# Altium schematic sheet [03] - POWER SUPPLY.SchDoc
size A3; DocumentNumber: 2; SheetNumber: 3; SheetTotal: 9
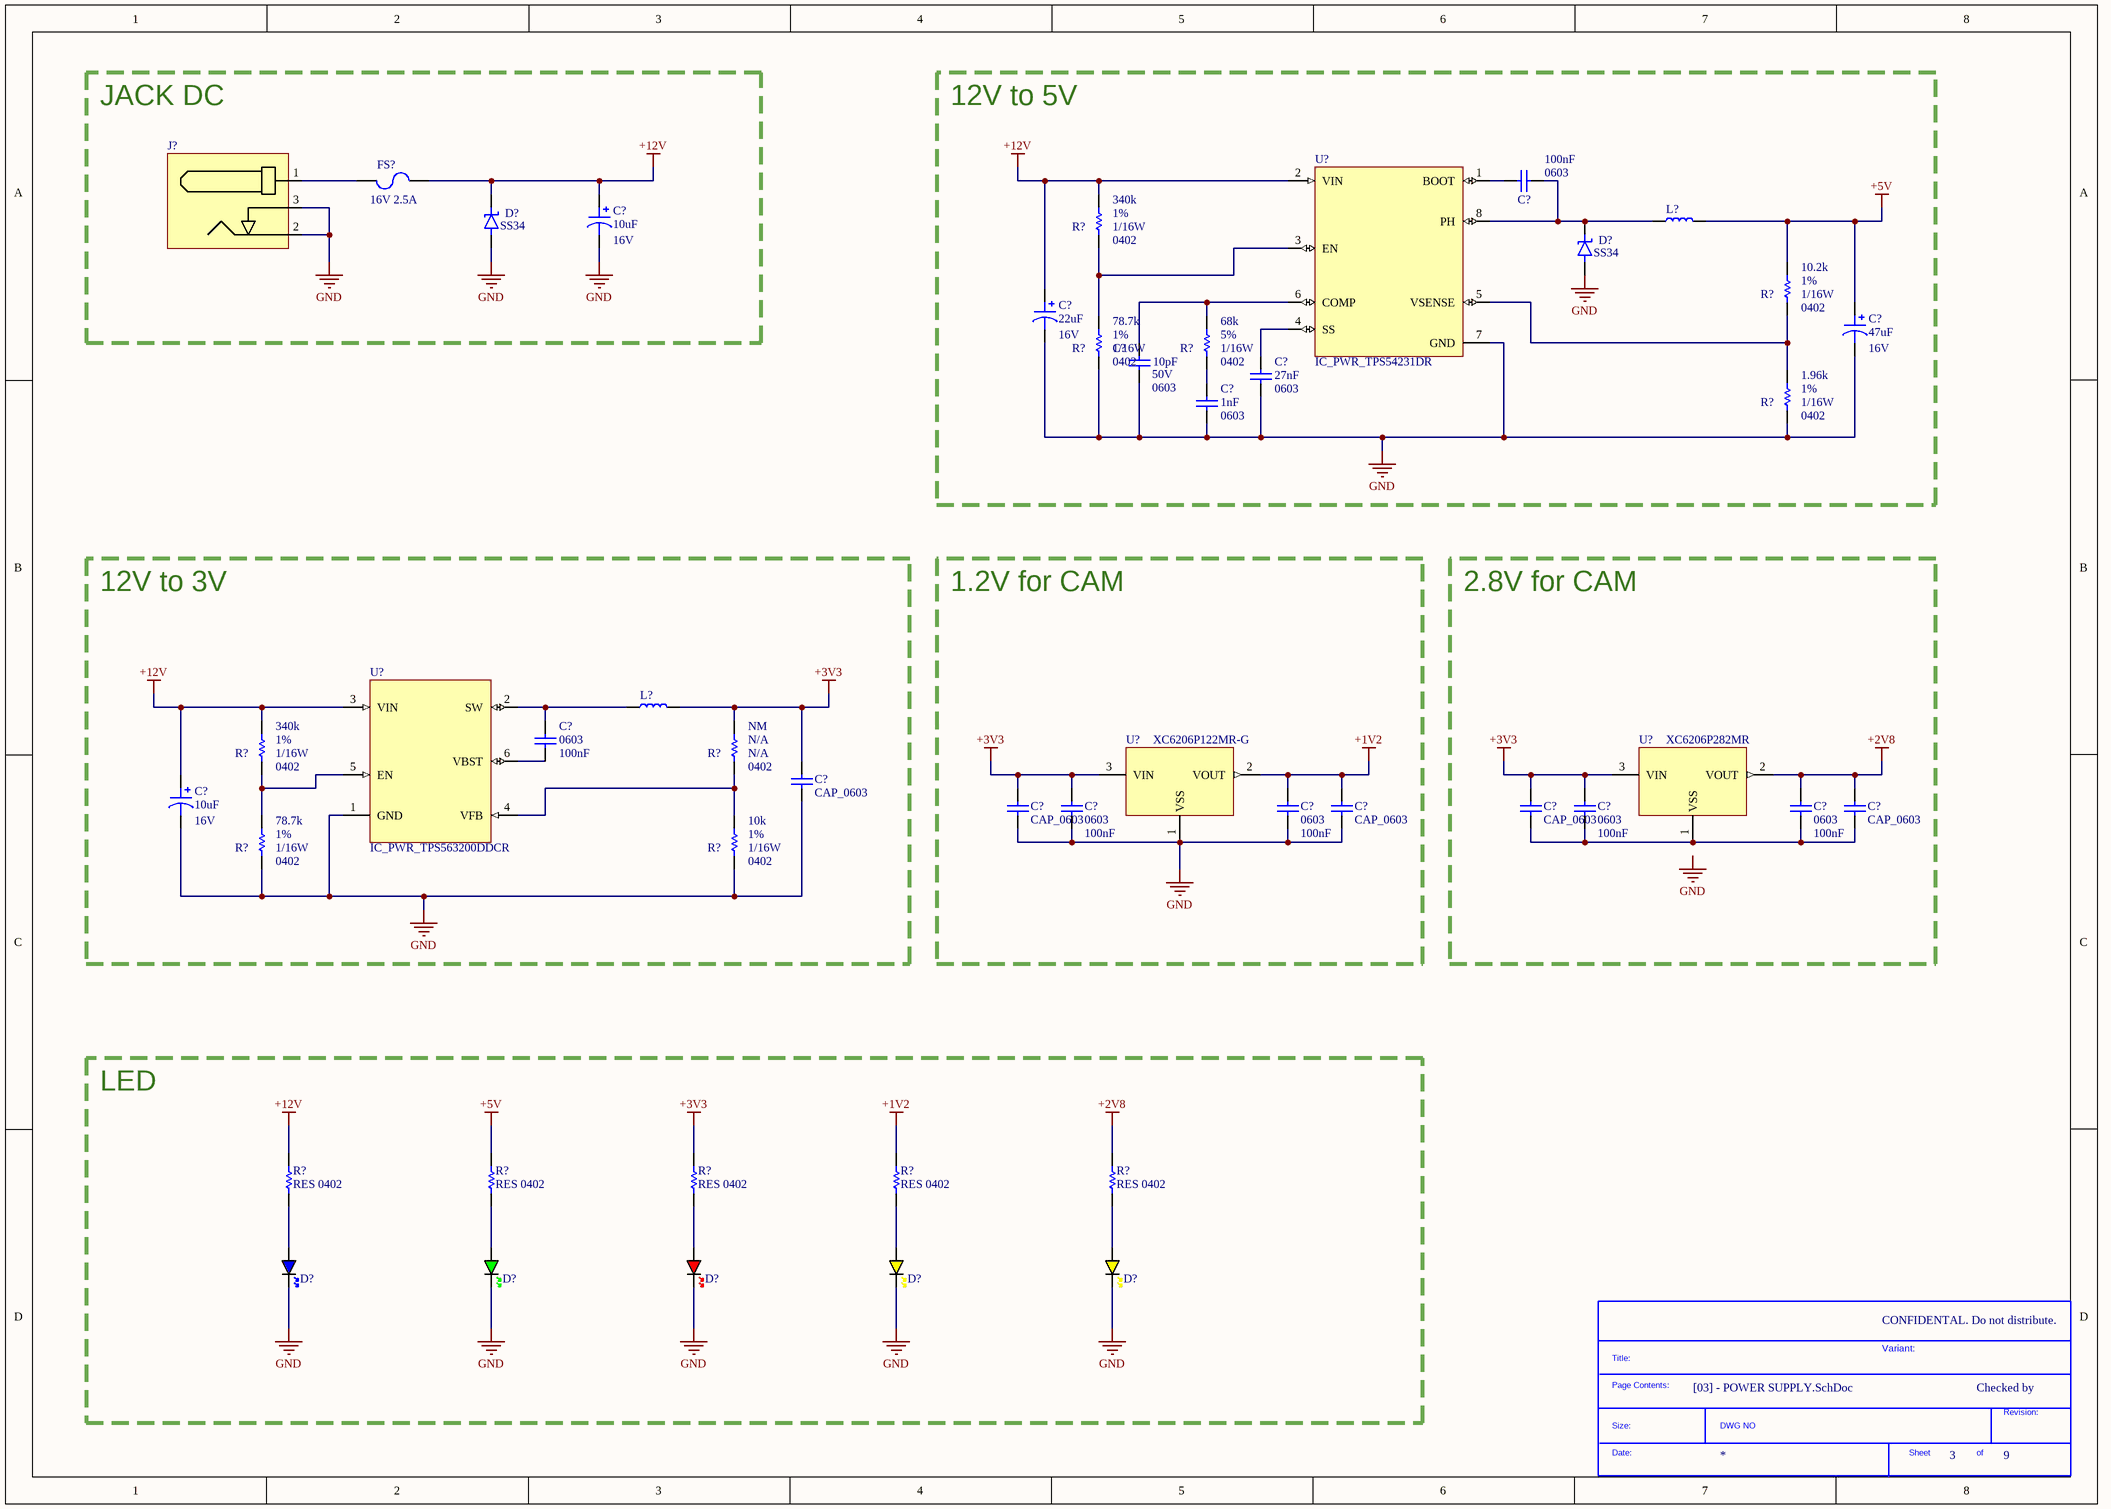
[diagram p0: [03] - POWER SUPPLY.SchDoc]

## Parts
(Parts that share a designator on the sheet are numbered #1, #2 ... from top to bottom, then left to right.)
*  SDTitleBlock  (value not drawn)  (graphical)
C?#1  Package / Case: 0603  Capacitance: 100nF  [CAP_0603]  (hidden comment: CAP_0603)
C?#2  10uF  Voltage Rating DC: 16V  [CAP TAN 1411]
C?#3  22uF  Voltage Rating DC: 16V  [CAP_TAN-2312]
C?#4  47uF  Voltage Rating DC: 16V  [CAP_TAN-2312]
C?#5  Voltage Rating DC: 50V  Package / Case: 0603  Capacitance: 10pF  [CAP_0603]  (hidden comment: CAP_0603)
C?#6  Package / Case: 0603  Capacitance: 27nF  [CAP_0603]  (hidden comment: CAP_0603)
C?#7  Package / Case: 0603  Capacitance: 1nF  [CAP_0603]  (hidden comment: CAP_0603)
C?#8  Package / Case: 0603  Capacitance: 100nF  [CAP_0603]  (hidden comment: CAP_0603)
C?#9  Package / Case: 0603  Capacitance: 100nF  [CAP_0603]  (hidden comment: CAP_0603)
C?#10  Package / Case: 0603  Capacitance: 100nF  [CAP_0603]  (hidden comment: CAP_0603)
C?#11  Package / Case: 0603  Capacitance: 100nF  [CAP_0603]  (hidden comment: CAP_0603)
C?#12  Package / Case: 0603  Capacitance: 100nF  [CAP_0603]  (hidden comment: CAP_0603)
C?#13  10uF  Voltage Rating DC: 16V  [CAP TAN 1206]
C?#14  CAP_0603  [CAP_0603]
C?#15  CAP_0603  [CAP_0603]
C?#16  CAP_0603  [CAP_0603]
C?#17  CAP_0603  [CAP_0603]
C?#18  CAP_0603  [CAP_0603]
D?#1  SS34  [DO-214AC-2 (SMA)]
D?#2  SS34  [DO-214AC-2 (SMA)]
D?#3  BLUE  [LED_0603_BLUE]  (value not drawn)
D?#4  GREEN  [LED_0603_GREEN]  (value not drawn)
D?#5  RED  [LED_0603_BLUE]  (value not drawn)
D?#6  YELLOW  [LED_0603_YELLOW]  (value not drawn)
D?#7  YELLOW  [LED_0603_YELLOW]  (value not drawn)
FS?  16V 2.5A  [FUSE_1812]
J?  DC-005-5A-3.0  [CONN_PWR_DC-005-5A-3.0]  (value not drawn)
L?#1  L0603  [IND_0603]  (value not drawn)
L?#2  L0402  [IND_0402]  (value not drawn)
R?#1  Tolerance: 1%  Rated Power: 1/16W  Package / Case: 0402  Resistance: 340k  [RES_0402]  (hidden comment: RES 0402)
R?#2  Tolerance: 1%  Rated Power: 1/16W  Package / Case: 0402  Resistance: 10.2k  [RES_0402]  (hidden comment: RES 0402)
R?#3  Tolerance: 1%  Rated Power: 1/16W  Package / Case: 0402  Resistance: 78.7k  [RES_0402]  (hidden comment: RES 0402)
R?#4  Tolerance: 5%  Rated Power: 1/16W  Package / Case: 0402  Resistance: 68k  [RES_0402]  (hidden comment: RES 0402)
R?#5  Tolerance: 1%  Rated Power: 1/16W  Package / Case: 0402  Resistance: 1.96k  [RES_0402]  (hidden comment: RES 0402)
R?#6  Tolerance: 1%  Rated Power: 1/16W  Package / Case: 0402  Resistance: 340k  [RES_0402]  (hidden comment: RES 0402)
R?#7  Package / Case: 0402  Resistance: NM  [RES_0402]  (hidden comment: RES 0402)
R?#8  Tolerance: 1%  Rated Power: 1/16W  Package / Case: 0402  Resistance: 78.7k  [RES_0402]  (hidden comment: RES 0402)
R?#9  Tolerance: 1%  Rated Power: 1/16W  Package / Case: 0402  Resistance: 10k  [RES_0402]  (hidden comment: RES 0402)
R?#10  RES 0402  [RES_0402]
R?#11  RES 0402  [RES_0402]
R?#12  RES 0402  [RES_0402]
R?#13  RES 0402  [RES_0402]
R?#14  RES 0402  [RES_0402]
U?#1  IC_PWR_TPS54231DR  [PKG_SOIC-8]
U?#2  IC_PWR_TPS563200DDCR  [PKG_SOT-23-6]
U?#3  XC6206P122MR-G  [PKG_SOT-23-3]
U?#4  XC6206P282MR  [PKG_SOT-23-3]

## Blocks framed on the sheet
JACK DC: C?#2 D?#1 FS? J?
12V to 5V: C?#1 C?#3-C?#7 D?#2 L?#1 R?#1-R?#5 U?#1
12V to 3V: C?#8 C?#13 C?#14 L?#2 R?#6-R?#9 U?#2
1.2V for CAM: C?#9 C?#10 C?#15 C?#16 U?#3
2.8V for CAM: C?#11 C?#12 C?#17 C?#18 U?#4
LED: D?#3-D?#7 R?#10-R?#14

## Nets
+1V2: C?#10.1 C?#16.2 R?#13.2 U?#3.2(VOUT)
+2V8: C?#12.1 C?#18.2 R?#14.2 U?#4.2(VOUT)
+3V3: C?#9.1 C?#11.1 C?#14.2 C?#15.2 C?#17.2 L?#2.2 R?#7.2 R?#12.2 U?#3.3(VIN) U?#4.3(VIN)
+5V: C?#4.1 L?#1.2 R?#2.2 R?#11.2
+12V: C?#2.1 C?#3.1 C?#13.1 D?#1.K FS?.2 R?#1.2 R?#6.2 R?#10.2 U?#1.2(VIN) U?#2.3(VIN)
GND: C?#2.2 C?#3.2 C?#4.2 C?#5.1 C?#6.1 C?#7.1 C?#9.2 C?#10.2 C?#13.2 C?#14.1 C?#15.1 C?#16.1 D?#1.A D?#2.A D?#3.K D?#4.K D?#5.K D?#6.K D?#7.K J?.2 J?.3 R?#3.1 R?#5.1 R?#8.1 R?#9.1 U?#1.7(GND) U?#2.1(GND) U?#3.1(VSS)
NetC?#1_1: C?#1.1 D?#2.K L?#1.1 U?#1.8(PH)
NetC?#1_2: C?#1.2 U?#1.1(BOOT)
NetC?#5_2: C?#5.2 R?#4.2 U?#1.6(COMP)
NetC?#6_2: C?#6.2 U?#1.4(SS)
NetC?#7_2: C?#7.2 R?#4.1
NetC?#8_1: C?#8.1 L?#2.1 U?#2.2(SW)
NetC?#8_2: C?#8.2 U?#2.6(VBST)
NetC?#11_2: C?#11.2 C?#12.2 C?#17.1 C?#18.1 U?#4.1(VSS)
NetD?#3_A: D?#3.A R?#10.1
NetD?#4_A: D?#4.A R?#11.1
NetD?#5_A: D?#5.A R?#12.1
NetD?#6_A: D?#6.A R?#13.1
NetD?#7_A: D?#7.A R?#14.1
NetFS?_1: FS?.1 J?.1
NetR?#1_1: R?#1.1 R?#3.2 U?#1.3(EN)
NetR?#2_1: R?#2.1 R?#5.2 U?#1.5(VSENSE)
NetR?#6_1: R?#6.1 R?#8.2 U?#2.5(EN)
NetR?#7_1: R?#7.1 R?#9.2 U?#2.4(VFB)

## Notes on the sheet
- CLOCKS (CPU & PCIE)
- CONFIDENTAL. Do not distribute.
- Variant:
- Checked by
- Labels drawn without touching a wire or pin: GND
- (in symbol SDTitleBlock) Title:; Page Contents:; Revision:; Size:; DWG NO; Date:; Sheet; of

## Library data of the parts
C?#1 C?#6 C?#8-C?#12 = CAP_0603_NM: CAP, size 0603, NM, N/A; Tolerance: 10%; Voltage Rating DC: 50V; Packaging: Tape and Reel; Supplier: thegioiic; ComponentLink1Description: Datasheet; ComponentLink1URL: N/A; Mount: SMD/SMT; Operating Temperature Max: + 85 C; Operating Temperature Min: - 40 C
  C?#1 C?#8-C?#12: Supplier URL: https://www.thegioiic.com/tu-gom-0603-100nf-0-1uf-50v; Supplier Part Number: Tụ Gốm 0603 100nF (0.1uF) 50V
  C?#6: Supplier URL: https://www.thegioiic.com/tu-gom-0603-27nf-50v; Supplier Part Number: Tụ Gốm 0603 27nF 50V
C?#2-C?#4 = CAP_POL_NM: CAP, size NM, NM, N/A; Tolerance: 10%; Packaging: Tape and Reel; Supplier: thegioiic; ComponentLink1Description: Datasheet; ComponentLink1URL: N/A; Mount: SMD/SMT; Operating Temperature Max: + 85 C; Operating Temperature Min: - 40 C; Material: NM
  C?#2: Capacitance: 10uF; Supplier URL: https://www.thegioiic.com/tu-tantalum-10uf-16v-1206-taja106k016rnj; Supplier Part Number: TAJA106K016RNJ; Package / Case: N/A
  C?#3: Capacitance: 22uF; Supplier URL: https://www.thegioiic.com/tu-tantalum-22uf-16v-2312-tajc226k016rnj; Supplier Part Number: TAJC226K016RNJ; Package / Case: 2312
  C?#4: Capacitance: 47uF; Supplier URL: https://www.thegioiic.com/tu-tantalum-47uf-16v-2312-tajc476k016rnj; Supplier Part Number: TAJC476K016RNJ; Package / Case: 2312
C?#5 = CAP_0603_NM: CAP, size 0603, NM, N/A; Tolerance: 10%; Packaging: Tape and Reel; Supplier URL: https://www.thegioiic.com/tu-gom-0603-10pf-50v; Supplier: thegioiic; Supplier Part Number: Tụ Gốm 0603 10pF 50V; ComponentLink1Description: Datasheet; ComponentLink1URL: N/A; Mount: SMD/SMT; Operating Temperature Max: + 85 C; Operating Temperature Min: - 40 C
C?#7 = CAP_0603_NM: CAP, size 0603, NM, N/A; Tolerance: 10%; Voltage Rating DC: 50; Packaging: Tape and Reel; Supplier URL: https://www.thegioiic.com/tu-gom-0603-1nf-50v; Supplier: thegioiic; Supplier Part Number: Tụ Gốm 0603 1nF 50V; ComponentLink1Description: Datasheet; ComponentLink1URL: N/A; Mount: SMD/SMT; Operating Temperature Max: + 85 C; Operating Temperature Min: - 40 C
C?#13 = CAP_POL_NM: CAP, size NM, NM, N/A; Tolerance: 10%; Material: Tanta; Packaging: Tape and Reel; Capacitance: 10uF; Supplier URL: https://www.thegioiic.com/tu-tantalum-10uf-16v-1206-taja106k016rnj; Supplier: thegioiic; Supplier Part Number: TAJA106K016RNJ; ComponentLink1Description: Datasheet; ComponentLink1URL: N/A; Mount: SMD/SMT; Operating Temperature Max: + 85 C; Operating Temperature Min: - 40 C; Package / Case: 1206
C?#14-C?#18 = CAP_0603_NM: CAP, size 0603, NM, N/A; Packaging: Tape and Reel; Capacitance: N/A; Supplier URL: N/A; Tolerance: N/A; Voltage Rating DC: N/A; Supplier: N/A; Supplier Part Number: N/A; ComponentLink1Description: Datasheet; ComponentLink1URL: N/A; Mount: SMD/SMT; Operating Temperature Max: + 85 C; Operating Temperature Min: - 40 C; Package / Case: 0603
D?#1 D?#2 = D_SCHOTTKY_SMA: Diode Schottky SMD SMA (DO-214AA); Supplier: thegioiic; Supplier Part Number: TWGMC SS34 SMA; Supplier URL: https://www.thegioiic.com/twgmc-ss34-sma-diode-schottky-3a
D?#3 = LED_0603_BLUE: LED 0603 BLUE SMD; COLOR: BLUE; SIZE: 0603; Supplier: N/A; Supplier Part Number: N/A; Supplier URL: N/A
D?#4 = LED_0603_GREEN: LED 0603 GREEN SMD; COLOR: GREEN; SIZE: 0603; Supplier: N/A; Supplier Part Number: N/A; Supplier URL: N/A
D?#5 = LED_0603_RED: LED 0603 RED SMD; COLOR: RED; SIZE: 0603; Supplier: N/A; Supplier Part Number: N/A; Supplier URL: N/A
D?#6 D?#7 = LED_0603_YELLOW: LED 0603 YELLOW SMD; COLOR: YELLOW; SIZE: 0603; Supplier: N/A; Supplier Part Number: N/A; Supplier URL: N/A
FS? = FUSE_1206: Fuse; Supplier backup URL: N/A; Packaging: Tape and Reel; Supplier: thegioiic; Supplier Part Number: MF-MSMF250/16; Supplier backup: N/A; Supplier backup Part Number: N/A; Tolerance: N/A; Manufacturer: N/A; Manufacturer Part Number: N/A; ComponentLink1Description: Datasheet; ComponentLink1URL: N/A; Mount: SMD/SMT; Operating Temperature Max: + 85 C; Operating Temperature Min: - 40 C; Package / Case: 0402; Value: 16V 2.5A; Supplier URL: https://www.thegioiic.com/mf-msmf250-16-cau-chi-tu-phuc-hoi-1812-16v-2-5a
J? = PWR_DC-005-5A-3.0: DC Barrell Jack 6.2mm 5 A3.0mm Through Hole; Supplier: N/A; Supplier Part Number: DC-005-5A-3.0; Supplier URL: N/A
L?#1 = IND_0603: Inductor SMD 0603
L?#2 = IND_SMD: Inductor SMD; Inductance: NM; Current: NM; Supplier: NM; Supplier Part Number: NM; Supplier URL: NM
R?#1 R?#6 = RES_0402_NM: RES, size 0402, NM, N/A; Manufacturer: YAGEO; Manufacturer Part Number: RC0402FR-07340KL; Supplier backup URL: https://www.mouser.vn/ProductDetail/YAGEO/RC0100FR-07340KL?qs=tggtontpCXM9OHWbJDQFHg%3D%3D; Packaging: Tape and Reel; Supplier: Digikey; Supplier Part Number: YAG3121TR-ND; Supplier backup: Mouser; Supplier backup Part Number: 603-RC0100FR-07340KL; ComponentLink1Description: Datasheet; ComponentLink1URL: N/A; Mount: SMD/SMT; Operating Temperature Max: + 85 C; Operating Temperature Min: - 40 C; Supplier URL: https://www.digikey.com/en/products/detail/yageo/RC0402FR-07340KL/5280981
R?#2 = RES_0402_NM: RES, size 0402, NM, N/A; Manufacturer: YAGEO; Manufacturer Part Number: RC0402FR-0710K2L; Supplier backup URL: https://www.mouser.vn/ProductDetail/YAGEO/AC0402FR-0710K2L?qs=sGAEpiMZZMtlubZbdhIBIK4ZiD9DMvaKbrPGG0oO2No%3D; Packaging: Tape and Reel; Supplier: Digikey; Supplier Part Number: YAG2950TR-ND; Supplier backup: Mouser; Supplier backup Part Number: 603-AC0402FR-0710K2L; ComponentLink1Description: Datasheet; ComponentLink1URL: N/A; Mount: SMD/SMT; Operating Temperature Max: + 85 C; Operating Temperature Min: - 40 C; Supplier URL: N/A
R?#3 R?#8 = RES_0402_NM: RES, size 0402, NM, N/A; Manufacturer: YAGEO; Manufacturer Part Number: RT0402BRD0778K7L; Supplier backup URL: https://www.mouser.vn/ProductDetail/YAGEO/AF0402FR-0778K7L?qs=sGAEpiMZZMvdGkrng054t3GzUHVMl1SeZWxuGacPxef8KvweHjVoiA%3D%3D; Packaging: Tape and Reel; Supplier: Digikey; Supplier Part Number: YAG4311TR-ND; Supplier backup: Mouser; Supplier backup Part Number: 603-AF0402FR-0778K7L; ComponentLink1Description: Datasheet; ComponentLink1URL: N/A; Mount: SMD/SMT; Operating Temperature Max: + 85 C; Operating Temperature Min: - 40 C; Supplier URL: https://www.digikey.com/en/products/detail/yageo/RT0402BRD0778K7L/1069393
R?#4 R?#7 R?#9-R?#14 = RES_0402_NM: RES, size 0402, NM, N/A; Supplier backup URL: N/A; Packaging: Tape and Reel; Supplier backup: N/A; Supplier backup Part Number: N/A; ComponentLink1Description: Datasheet; ComponentLink1URL: N/A; Mount: SMD/SMT; Operating Temperature Max: + 85 C; Operating Temperature Min: - 40 C
  R?#4: Supplier: thegioiic; Supplier Part Number: Điện Trở 68 KOhm 0402 5%; LCSC Part #: N/A; Supplier URL: https://www.thegioiic.com/dien-tro-68-kohm-0402-5-
  R?#7: Supplier: N/A; Supplier Part Number: N/A; Manufacturer: N/A; Manufacturer Part Number: N/A; LCSC Part #: N/A; Supplier URL: N/A; Tolerance: N/A; Rated Power: N/A
  R?#9: Supplier: thegioiic; Supplier Part Number: N/A; Manufacturer: N/A; Manufacturer Part Number: N/A; Supplier URL: https://www.thegioiic.com/dien-tro-10-kohm-0402-1-
  R?#10-R?#14: Rated Power: N/A; Supplier: N/A; Supplier Part Number: N/A; Tolerance: N/A; Manufacturer: N/A; Manufacturer Part Number: N/A; Package / Case: 0402; LCSC Part #: N/A; Resistance: NM; Supplier URL: N/A
R?#5 = RES_0402_NM: RES, size 0402, NM, N/A; Manufacturer: YAGEO; Manufacturer Part Number: RC0402FR-071K96L; Supplier backup URL: https://www.mouser.vn/ProductDetail/YAGEO/RT0402FRE071K96L?qs=gY0y7AQI9SNNJ9oB6Obr3g%3D%3D; Packaging: Tape and Reel; Supplier: Digikey; Supplier Part Number: 311-1.96KLRTR-ND; Supplier backup: Mouser; Supplier backup Part Number: 603-RT0402FRE071K96L; ComponentLink1Description: Datasheet; ComponentLink1URL: N/A; Mount: SMD/SMT; Operating Temperature Max: + 85 C; Operating Temperature Min: - 40 C; Supplier URL: https://www.digikey.com/en/products/detail/yageo/RC0402FR-071K96L/726522
U?#1 = IC_PWR_TPS54231DR: 3.5 to 28V Input, 2A, 570kHz Step-Down Converter with Eco-modeâ„¢; Package: SOIC-8 Texas Instruments; Supplier: *; Supplier Part Number: *; Supplier URL: *
U?#2 = IC_PWR_TPS563200DDCR: 17 V Input, 3A Synchronous Step-Down Regulator in SOT-23 with Advanced Eco-modeâ„¢; MF: Texas Instruments; SnapEDA_Link: https://www.snapeda.com/parts/TPS563200DDCR/Texas+Instruments/view-part/?ref=snap; Package: SOT-23-THN-6 Texas Instruments; Value: *; MP: TPS563200DDCR; Check_prices: https://www.snapeda.com/parts/TPS563200DDCR/Texas+Instruments/view-part/?ref=eda
U?#3 = IC_PWR_XC6206P122MR-G: IC REG LINEAR 1.2V 60MA SOT23; Manufacturer_Name: Torex Semiconductor; Copyright: Copyright (C) 2025 Ultra Librarian. All rights reserved.; Manufacturer_Part_Number: XC6206P122MR-G; RefDes: RefDes; Type: Type
U?#4 = IC_PWR_XC6206P282MR: IC REG LINEAR 2.8V 100MA SOT23; Manufacturer_Name: Torex Semiconductor; Manufacturer_Part_Number: XC6206P122MR-G; Copyright: Copyright (C) 2025 Ultra Librarian. All rights reserved.; RefDes: RefDes; Type: Type